# Altium schematic sheet Headers.SchDoc
size A; SheetNumber: 7; SheetTotal: 14
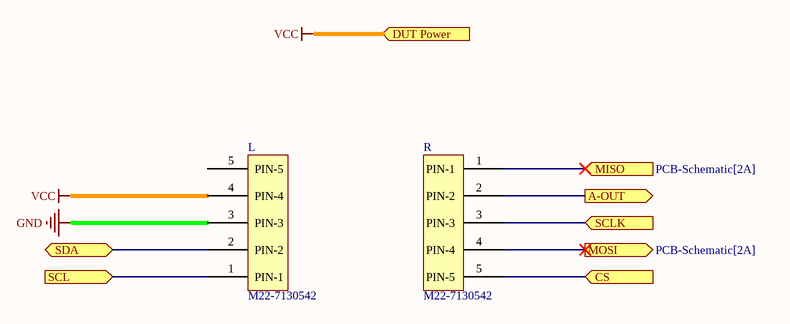
[diagram p0: Headers.SchDoc]

## Parts
L  M22-7130542  [RHDR5W50P0X200_1X5_1050X240X440P]
R  M22-7130542  [RHDR5W50P0X200_1X5_1050X240X440P]

## Ports
A-OUT (out, see PCB-Schematic[2A]), CS (in, see PCB-Schematic[2A]), DUT Power (in, see PCB-Schematic[1A]), MISO (in, see PCB-Schematic[2A]), MOSI (out, see PCB-Schematic[2A]), SCL (in, see PCB-Schematic[2A], OverviewRev2[4A], PCB-Schematic[2C]), SCLK (in, see PCB-Schematic[2A]), SDA (bidir, see PCB-Schematic[2A], OverviewRev2[4A], PCB-Schematic[2C])

## Nets
GND: L.3(PIN-3)
VCC: L.4(PIN-4) ; port DUT Power
A-OUT: R.2(PIN-2) ; port A-OUT
CS: R.5(PIN-5) ; port CS
MISO: R.1(PIN-1) ; port MISO
MOSI: R.4(PIN-4) ; port MOSI
SCL: L.1(PIN-1) ; port SCL
SCLK: R.3(PIN-3) ; port SCLK
SDA: L.2(PIN-2) ; port SDA

Not connected (* = marked no-connect by the designer): L 5(PIN-5)